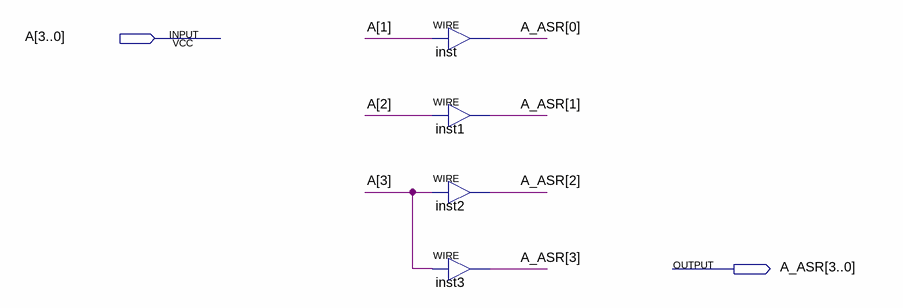
[diagram p0: schematic sheet]
// Quartus schematic ASR.bdf as structural Verilog: 4 symbols, 2 pins
module ASR (
  input  [3:0] A,
  output [3:0] A_ASR
);

  assign A_ASR[0] = A[1];  // WIRE inst
  assign A_ASR[1] = A[2];  // WIRE inst1
  assign A_ASR[2] = A[3];  // WIRE inst2
  assign A_ASR[3] = A[3];  // WIRE inst3
endmodule
